# Altium schematic sheet design_2.SchDoc: design
size 414 x 279 mm; Date: 1/25/2021 11:39:22 PM; SheetNumber: 3; Origin: Eagle; GateName_1: G$1; SymbolName_1: A3-L-GUMSTIX; LibraryName: qualified_1; DeviceSetName: A3-L-GUMSTIX; A: A; B: B; C: C; D: D; E: E; F: F; G: G; H: H; 1: 1; 2: 2; 3: 3; 4: 4; 5: 5; Sheet: Sheet:; C:/Gumstix/gumstix-logo-16.bmp: C:/Gumstix/gumstix-logo-16.bmp; Board: Board:
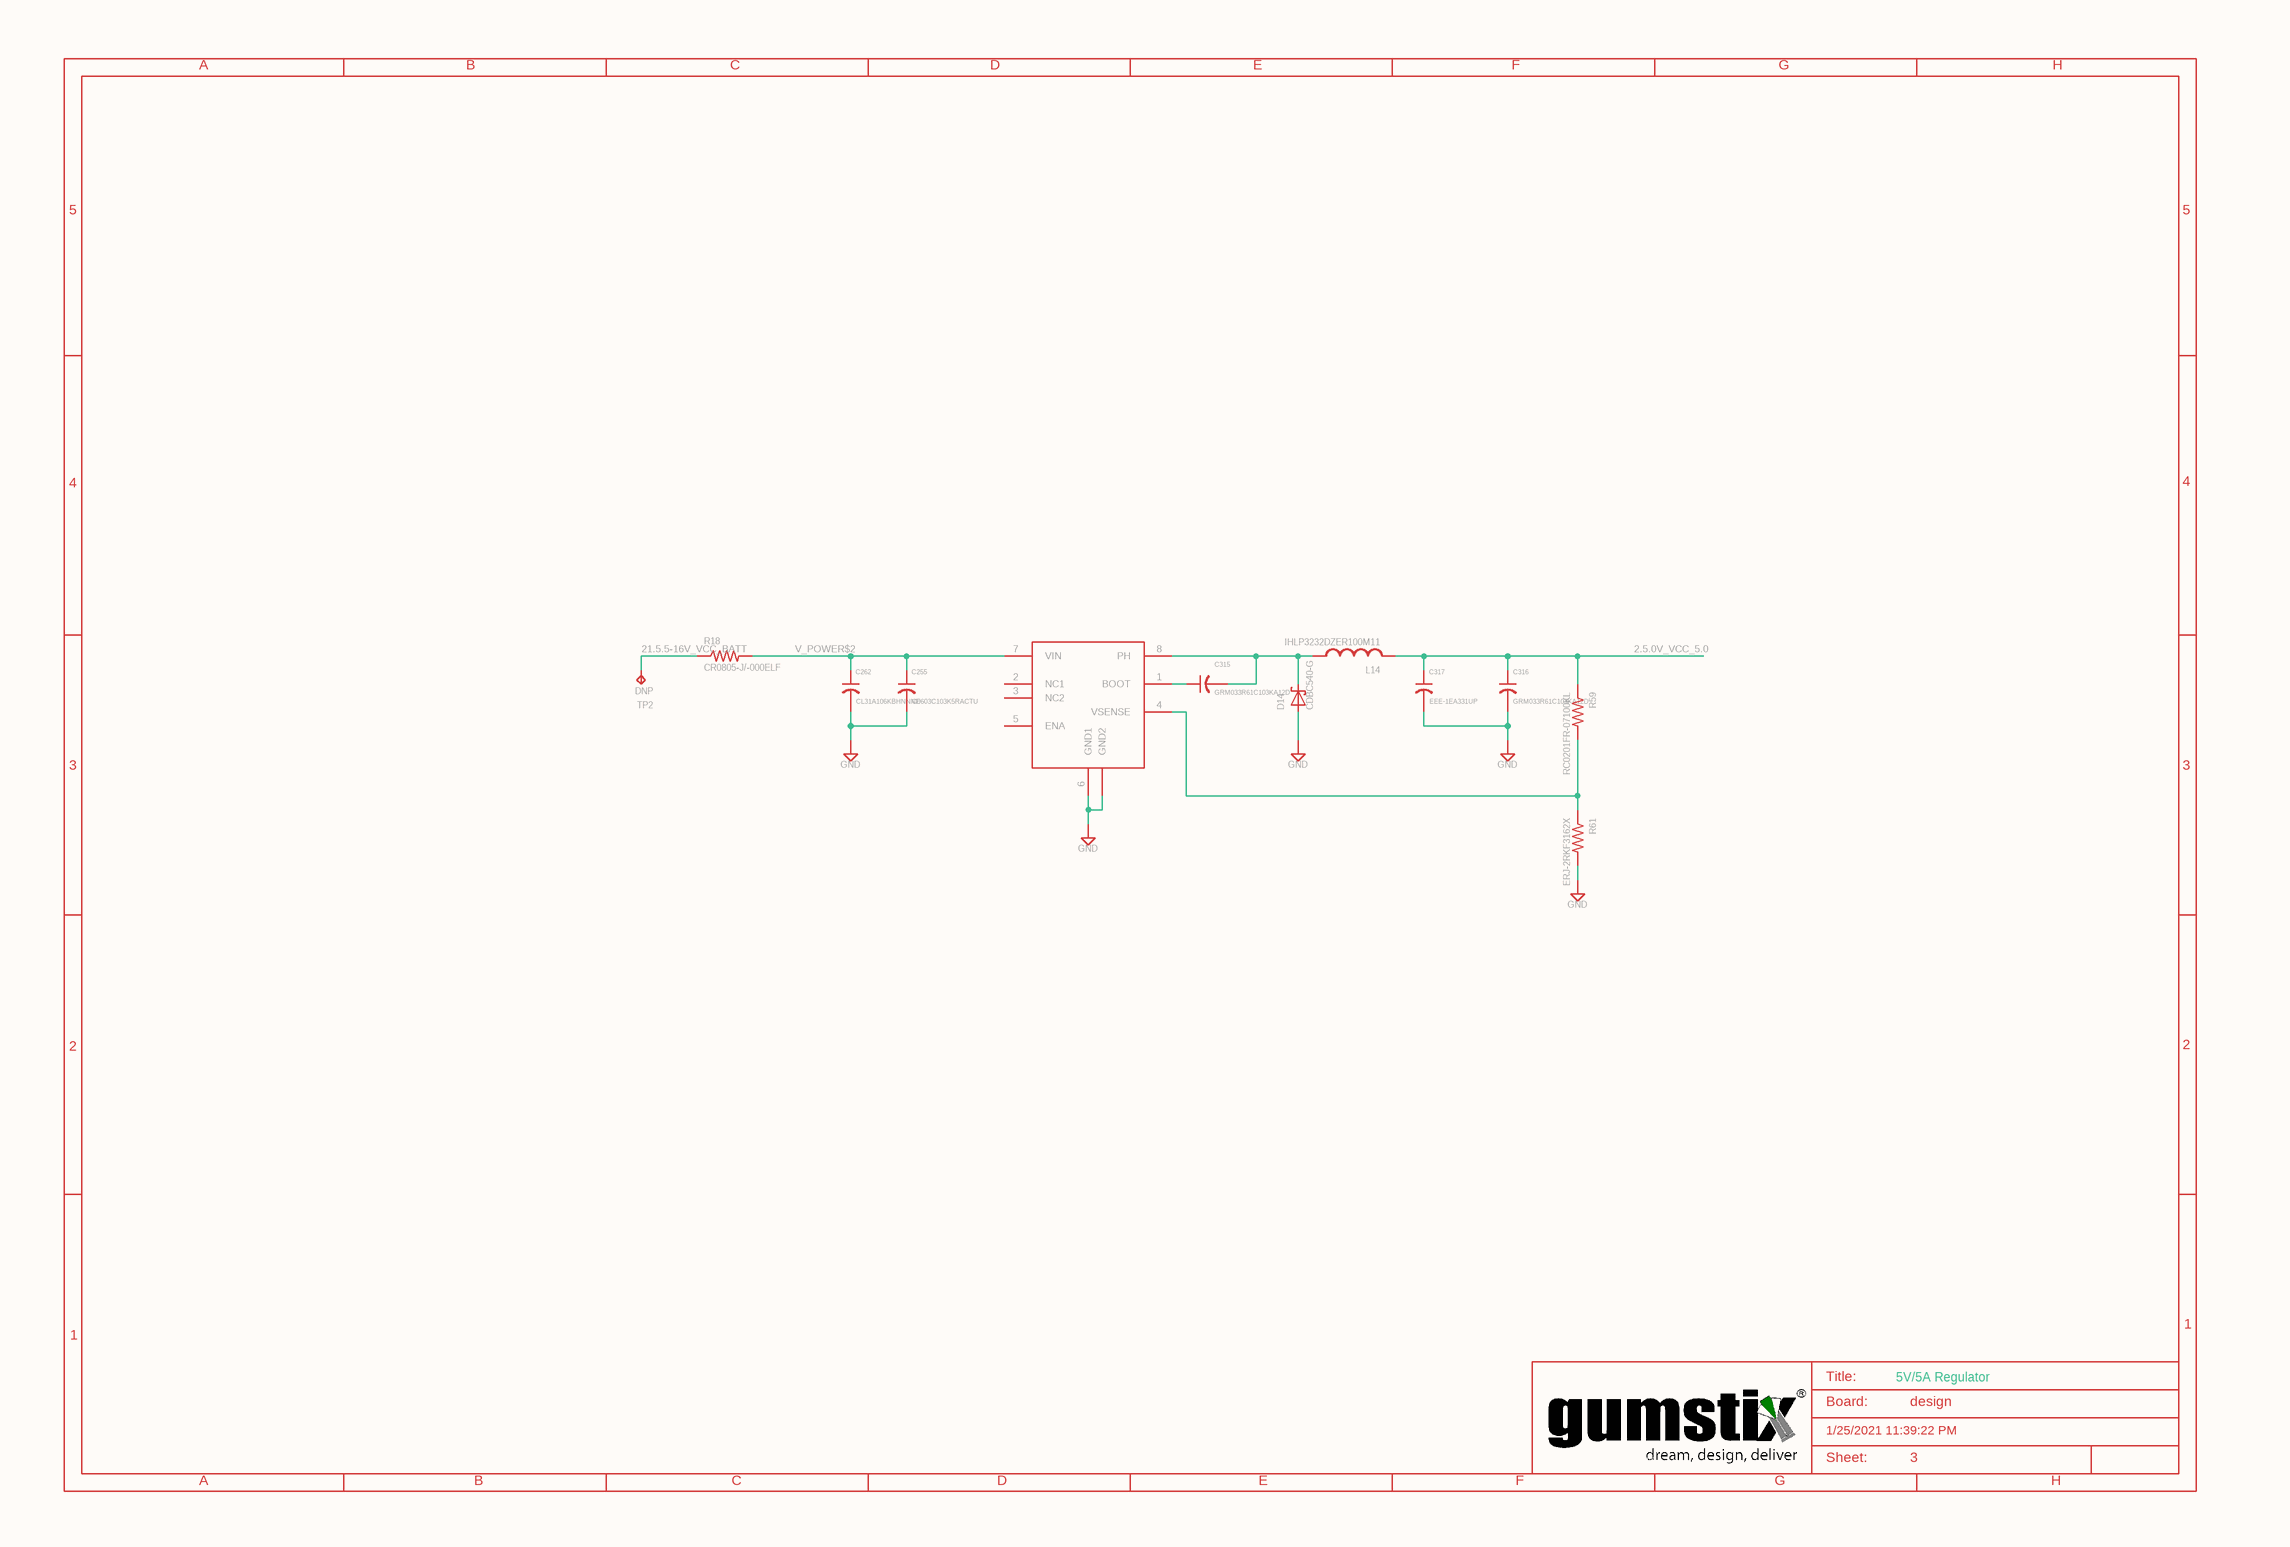
[diagram p0: design_2.SchDoc]

## Parts
C255  C0603C103K5RACTU  [0603]
C262  CL31A106KBHNNNE  [1206]
C315  GRM033R61C103KA12D  [0201]
C316  GRM033R61C103KA12D  [0201]
C317  EEE-1EA331UP  [PANASONIC_F]
D14  CDBC540-G  [DO-214AB]
L14  IHLP3232DZER100M11  [3232DZ]
R18  CR0805-J/-000ELF  [0805]
R59  RC0201FR-07100KL  [0201]
R61  ERJ-2RKF3162X  [0402]
SUPPLY132  GND
SUPPLY188  GND
SUPPLY189  GND
SUPPLY190  GND
SUPPLY191  GND
TP2  DNP  [TP0500]
U17  TPS5450QDDARQ1  [8SO_POWERPAD]  (value not drawn)

## Nets
2.5.0V_VCC_5.0: C316.1 C317.+ L14.2 R59.1
21.5.5-16V_VCC_BATT: R18.1 TP2.1(TP)
V_POWER$2: C255.1 C262.1 R18.2 U17.7(VIN)
NetC255_2: C255.2 C262.2 SUPPLY188.?1(GND)
NetC315_1: C315.1 U17.1(BOOT)
NetC315_2: C315.2 D14.C L14.1 U17.8(PH)
NetC316_2: C316.2 C317.- SUPPLY190.?1(GND)
NetD14_A: D14.A SUPPLY189.?1(GND)
NetR59_2: R59.2 R61.1 U17.4(VSENSE)
NetR61_2: R61.2 SUPPLY191.?1(GND)
NetSUPPLY132_?1: SUPPLY132.?1(GND) U17.6(GND1) U17.9_PWRPAD1_PWRPAD2_PWRPAD3_PWRPAD4_PWRPAD5_PWRPAD6_PWRPAD7_PWRPAD8(GND2)

Not connected (* = marked no-connect by the designer): U17 2(NC1) 3(NC2) 5(ENA)

## Notes on the sheet
- A
- B
- C
- D
- E
- F
- G
- H
- 5
- 4
- 3
- 2
- 1
- Title:
- Board:
- 5V/5A Regulator
- design
- C:/Gumstix/gumstix-logo-16.bmp
- 1/25/2021 11:39:22 PM
- Sheet:

## Library data of the parts
C255 = C0603C103K5RACTU: GateName_1: G$1; SymbolName_1: C-US; LibraryName: qualified_1@eagle_src_repo_f26ba765df9be4aea4dc36b2b99244de1327d3cb; DeviceSetName: C0603C103K5RACTU; HEIGHT: 0.5
C262 = CL31A106KBHNNNE: GateName_1: G$1; SymbolName_1: C-US; LibraryName: qualified_1@eagle_src_repo_f26ba765df9be4aea4dc36b2b99244de1327d3cb; DeviceSetName: CL31A106KBHNNNE; HEIGHT: 0.51
C315 C316 = GRM033R61C103KA12D: GateName_1: G$1; SymbolName_1: C-US; LibraryName: qualified_1@eagle_src_repo_f26ba765df9be4aea4dc36b2b99244de1327d3cb; DeviceSetName: GRM033R61C103KA12D; HEIGHT: 0.25
C317 = EEE-1EA331UP: GateName_1: G$1; SymbolName_1: C-US; LibraryName: qualified_1@eagle_src_repo_f26ba765df9be4aea4dc36b2b99244de1327d3cb; DeviceSetName: EEE-1EA331UP
D14 = CDBC540-G: Schottky Diode; GateName_1: G$1; SymbolName_1: SCHOTTKY; LibraryName: qualified_1; DeviceSetName: CDBC540-G
L14 = IHLP3232DZER100M11: GateName_1: G$1; SymbolName_1: L-US; LibraryName: qualified_1@eagle_src_repo_f26ba765df9be4aea4dc36b2b99244de1327d3cb; DeviceSetName: IHLP3232DZER100M11; DM: DM; DR: DR; DX: DX; DY: DY; SHEETNO: SHEETNO
R18 = CR0805-J/-000ELF: GateName_1: G$1; SymbolName_1: R-US; LibraryName: qualified_1@eagle_src_repo_f26ba765df9be4aea4dc36b2b99244de1327d3cb; DeviceSetName: CR0805-J/-000ELF; HEIGHT: 0.51
R59 = RC0201FR-07100KL: GateName_1: G$1; SymbolName_1: R-US; LibraryName: qualified_1@eagle_src_repo_f26ba765df9be4aea4dc36b2b99244de1327d3cb; DeviceSetName: RC0201FR-07100KL; DM: DM; DR: DR; DX: DX; DY: DY; HEIGHT: 0.25; SHEETNO: SHEETNO
R61 = ERJ-2RKF3162X: GateName_1: G$1; SymbolName_1: R-US; LibraryName: qualified_1@eagle_src_repo_f26ba765df9be4aea4dc36b2b99244de1327d3cb; DeviceSetName: ERJ-2RKF3162X; DM: DM; DR: DR; DX: DX; DY: DY; HEIGHT: 0.35; SHEETNO: SHEETNO
SUPPLY132 SUPPLY188-SUPPLY191 = GND: SUPPLY SYMBOL; GateName_1: GND; SymbolName_1: GND; LibraryName: supply2; DeviceSetName: GND
TP2 = TP05: GateName_1: G$1; SymbolName_1: TP; DeviceName: 05; LibraryName: qualified_1; DeviceSetName: TP; HEIGHT: 0
U17 = TPS5450QDDARQ1: GateName_1: G$1; SymbolName_1: TPS5450; LibraryName: qualified_1; DeviceSetName: TPS5450QDDARQ1